# EAGLE design 12V UPS2 (EAGLE 8.0.1)
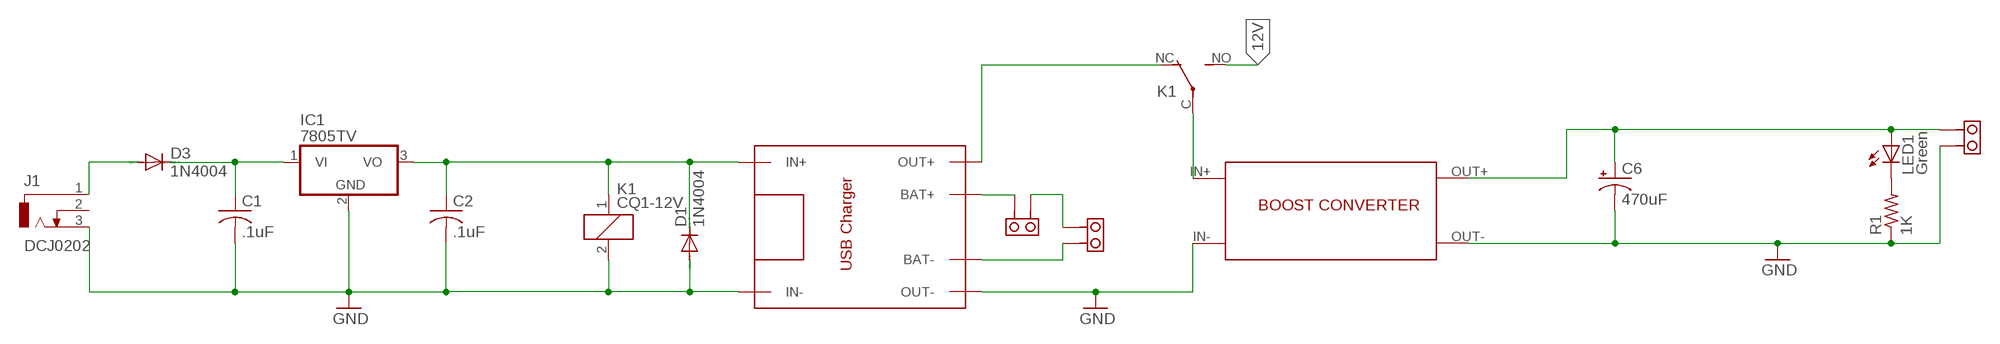
[diagram p0: schematic, sheet 1]

## Parts
C1  .1uF  C-US025-030X050  [C025-030X050]
C2  .1uF  C-US025-030X050  [C025-030X050]
C6  470uF  CPOL-USE5-8.5  [E5-8,5]
D1  1N4004  [DO41-10]
D3  1N4004  [DO41-10]
IC1  7805TV  [TO220V]
J1  DCJ0202  [DCJ0202]
K1  CQ1-12V  [CQ1]
LED1  Green  LED5MM  [LED5MM]
R1  1K  R-US_0204/2V  [0204V]
U$1  TP4056_TH  [TP4056_TH]
U$2  BOOST  [BOOST]
U$3  BERG_2  [BERG_2]
U$5  BERG_2  [BERG_2]
U$6  BERG_2  [BERG_2]

## Nets
12V: C1.1 D3.C IC1.1(VI) K1.NO(2:S)
BAT+: U$5.F U$6.F
BAT-: U$1.BAT- U$5.E
BOOST_IN+: K1.C(2:P) U$2.IN+
GND: C1.2 C2.2 C6.- D1.A IC1.2(GND) J1.3 K1.2 R1.1 U$1.IN- U$1.OUT- U$2.IN- U$2.OUT- U$3.E
N$2: D3.A J1.1
N$3: LED1.K(C) R1.2
N$5: C2.1 D1.C IC1.3(VO) K1.1 U$1.IN+
N$7: K1.NC(2:O) U$1.OUT+
N$8: C6.+ LED1.A U$2.OUT+ U$3.F
N$12: U$1.BAT+ U$6.E
Unconnected: J1.2

## Library data of the parts
C1 C2 = rcl:C-US: CAPACITOR, American symbol
C6 = rcl:CPOL-US: POLARIZED CAPACITOR, American symbol
D1 D3 = diode:1N4004: DIODE general purpose rectifier, 1 A
IC1 = linear:78*: Positive VOLTAGE REGULATOR Source: http://cache.national.com/ds/LM/LM78L05.pdf http://www.fairchildsemi.com/ds/LM/LM7805.pdf
J1 = con-jack:DCJ0202: DC POWER JACK Source: DCJ0202.pdf; OC_FARNELL: unknown; OC_NEWARK: unknown
K1 = relay:CQ1-12V: AUTOMOTIVE QUIET RELAY NAiS Source: http://www.mew-europe.com/.. en_ds_61208_0000.pdf; OC_FARNELL: unknown; OC_NEWARK: unknown
LED1 = led:LED: LED OSRAM: - CHIPLED LG R971, LG N971, LY N971, LG Q971, LY Q971, LO R971, LY R971 LH N974, LH R974 LS Q976, LO Q976, LY Q976 LO Q996 - Hyper CHIPLED LW Q18S LB Q993, LB Q99A, LB R99A - SideLED LS A670, LO A670, LY A670, LG A670, LP A670 LB A673, LV A673, LT A673, LW A673 LH A674 LY A675 LS A676, LA A676, LO A676, LY A676, LW A676 LS A679, LY A679, LG A679 - Hyper Micro SIDELED® LS Y876, LA Y876, LO Y876, LY Y876 LT Y87S - SmartLED LW L88C, LW L88S LB L89C, LB L89S, LG L890 LS L89K, LO L89K, LY L89K LS L896, LA L896, LO L896, LY L896 - TOPLED LS T670, LO T670, LY T670, LG T670, LP T670 LSG T670, LSP T670, LSY T670, LOP T670, LYG T670 LG T671, LOG T671, LSG T671 LB T673, LV T673, LT T673, LW T673 LH T674 LS T676, LA T676, LO T676, LY T676, LB T676, LH T676, LSB T676, LW T676 LB T67C, LV T67C, LT T67C, LS T67K, LO T67K, LY T67K, LW E67C LS E67B, LA E67B, LO E67B, LY E67B, LB E67C, LV E67C, LT E67C LW T67C LS T679, LY T679, LG T679 LS T770, LO T770, LY T770, LG T770, LP T770 LB T773, LV T773, LT T773, LW T773 LH T774 LS E675, LA E675, LY E675, LS T675 LS T776, LA T776, LO T776, LY T776, LB T776 LHGB T686 LT T68C, LB T68C - Hyper Mini TOPLED® LB M676 - Mini TOPLED Santana® LG M470 LS M47K, LO M47K, LY M47K Source: http://www.osram.convergy.de LUXEON: - LUMILED® LXK2-PW12-R00, LXK2-PW12-S00, LXK2-PW14-U00, LXK2-PW14-V00 LXK2-PM12-R00, LXK2-PM12-S00, LXK2-PM14-U00 LXK2-PE12-Q00, LXK2-PE12-R00, LXK2-PE12-S00, LXK2-PE14-T00, LXK2-PE14-U00 LXK2-PB12-K00, LXK2-PB12-L00, LXK2-PB12-M00, LXK2-PB14-N00, LXK2-PB14-P00, LXK2-PB14-Q00 LXK2-PR12-L00, LXK2-PR12-M00, LXK2-PR14-Q00, LXK2-PR14-R00 LXK2-PD12-Q00, LXK2-PD12-R00, LXK2-PD12-S00 LXK2-PH12-R00, LXK2-PH12-S00 LXK2-PL12-P00, LXK2-PL12-Q00, LXK2-PL12-R00 Source: www.luxeon.com KINGBRIGHT: KA-3528ASYC Source: www.kingbright.com
R1 = rcl:R-US_: RESISTOR, American symbol
U$1 = TP4056 charging module:TP4056_TH
U$2 = boost:BOOST
U$3 U$5 U$6 = dragCustom:BERG_2

## Board
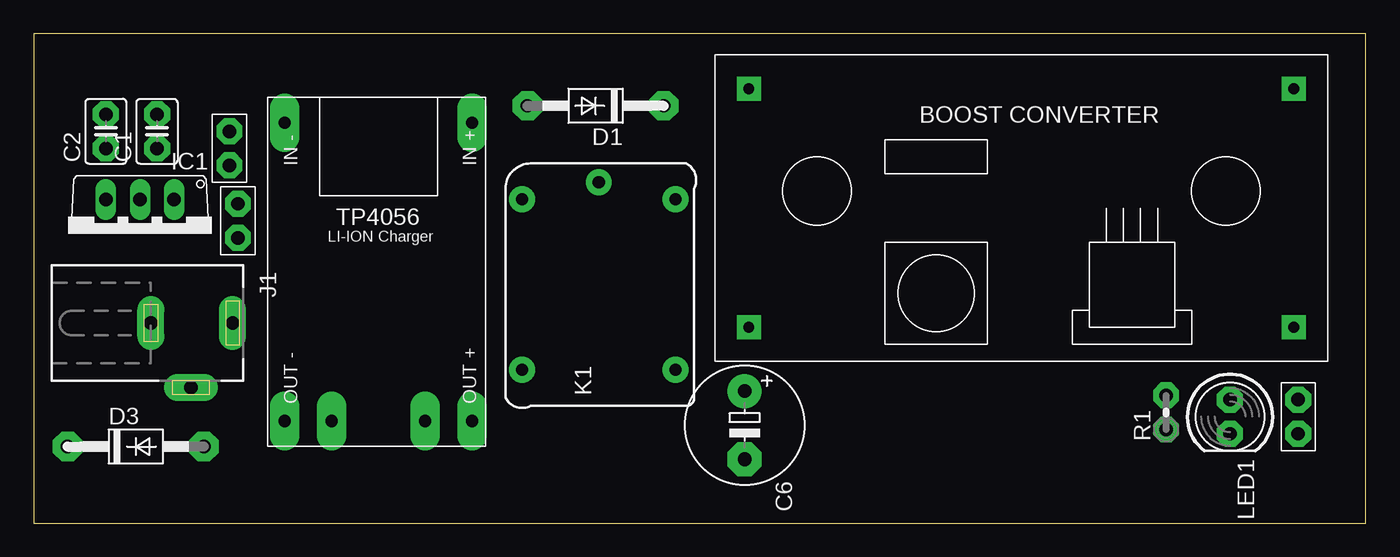
[diagram p1: board, top side]
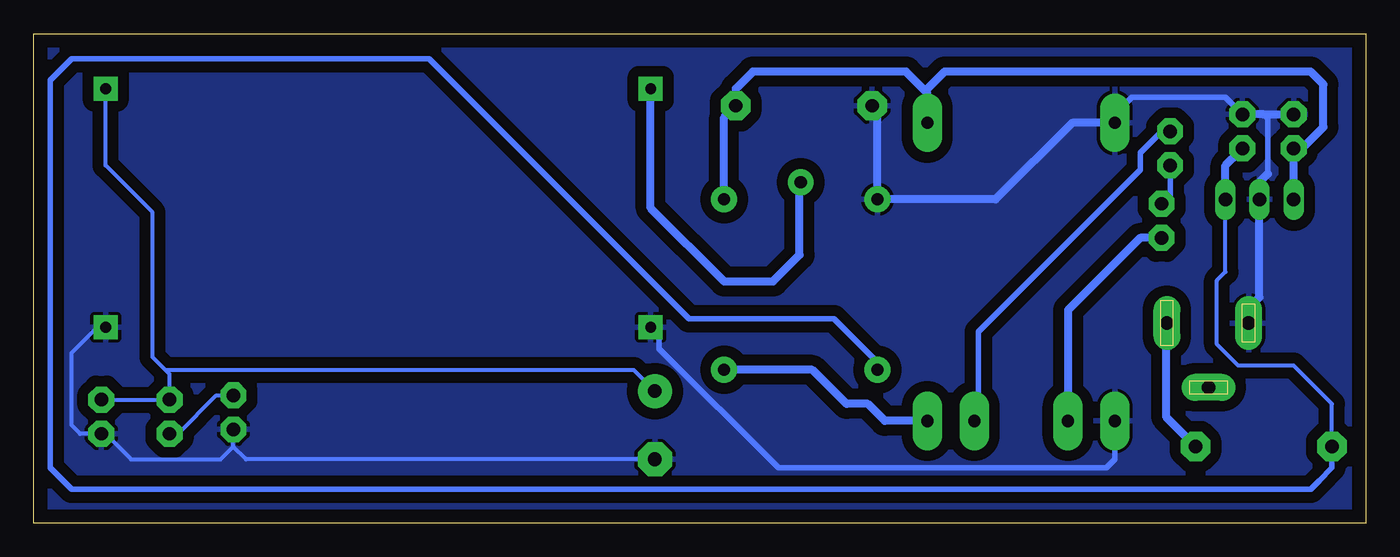
[diagram p2: board, bottom side, seen from below]

Size 99.36 x 36.5 mm. Coordinates in mm from the lower left corner, seen from the top.
Outline: 0,0 99.36,0 99.36,36.5 0,36.5 0,0
Copper layers (1*16): Top 0.035mm / dielectric 1.5mm / Bottom 0.035mm
Design rules "default": minimum track width 10mil, minimum drill 24mil, track to track 8mil, track to pad 8mil, pad to pad 8mil, via to via 8mil, smd to smd 8mil, copper to edge 40mil, drill to drill 8mil, minimum pad ring 10mil, minimum via ring 8mil, stop-mask expansion 4mil, vias tented up to drill 0mil, thermal gap 10mil

### Footprints (pad centres in the part's own frame; a part is rotated, then mirrored left to right if it is on the bottom)
C025-030X050 = drill 1 pad 1.93 octagon: 1 -1.27,0; 2 1.27,0
E5-8,5 = drill 1.016 pad 2.54: + -2.54,0 | drill 1.016 pad 2.54 octagon: - 2.54,0
DO41-10 = drill 1 pad 2.184 octagon: A 5.08,0; C -5.08,0
TO220V = drill 1.016 long: 1 -2.54,-2.54; 2 0,-2.54; 3 2.54,-2.54
DCJ0202 = drill 1 pad 2 long: 1 0,3.1; 2 4.8,0; 3 0,-3
CQ1 = drill 0.9 pad 1.93: 1 7,-5; 2 7,6.43; C 8.27,0.715; NC -5.7,-5; NO -5.7,6.43
LED5MM = drill 1 pad 1.93 octagon: A -1.27,0; K 1.27,0
0204V = drill 1 pad 1.93 octagon: 1 -1.27,0; 2 1.27,0
TP4056_TH = drill 0.9 pad 2.184 long: BAT+ 4.128,-11.43; BAT- -2.857,-11.43; IN+ 7.62,10.795; IN- -6.35,10.795; OUT+ 7.62,-11.43; OUT- -6.35,-11.43
BOOST = drill 0.8 pad 1.778 square: IN+ -20.32,10.16; IN- -20.32,-7.62; OUT+ 20.32,10.16; OUT- 20.32,-7.62
BERG_2 = drill 1 pad 1.93 octagon: E 0,2.54; F 0,0

### Placement (x,y rotation side)
C1  9.21,29.21 90 top
C2  5.4,29.21 90 top
C6  53.02,7.3 270 top
D1  41.91,31.11 180 top
D3  7.62,5.71 0 top
IC1  7.94,21.59 180 top
J1  11.75,14.92 270 top
K1  42.86,17.14 90 top
LED1  89.22,7.94 270 top
R1  84.45,8.26 90 top
U$1  25.08,19.05 0 top
U$2  73.66,22.23 0 top
U$3  94.3,9.21 180 top
U$5  15.24,23.81 180 top
U$6  14.61,26.67 0 top

### Tracks (layer width: path | path; a pad name or v marks a point on that pad's centre or on a via)
12V
  Bottom 0.305: D3.C 2.54,8.89 5.4,11.75 9.53,11.75 11.11,13.34 11.11,18.1 10.48,18.73 IC1.1 | K1.NO 36.43,11.98 | 3.49,3.17 4.13,2.54
  Bottom 0.406: 9.53,27.62 C1.1 | 36.43,11.98 39.69,15.24 50.48,15.24 69.85,34.61 96.52,34.61 98.11,33.02 98.11,4.13 96.52,2.54 4.13,2.54 3.49,3.17 2.54,4.13 D3.C
  Bottom 0.61: IC1.1 10.48,26.67 9.53,27.62
BAT+
  Bottom 0.406: U$6.F 14.61,24.45 U$5.F
BAT-
  Bottom 0.61: U$5.E 16.83,21.27 22.22,15.88 U$1.BAT-
BOOST_IN+
  Bottom 0.305: 42.23,25.34 K1.C
  Bottom 0.61: U$2.IN+ 53.34,23.5 47.86,18.02 44.21,18.02 42.23,20 42.23,25.34
GND
  Bottom 0.305: 84.45,5.71 85.41,4.76 92.08,4.76 93.98,6.67 U$3.E 95.88,6.67 96.52,7.3 96.52,12.7 94.61,14.61 U$2.OUT- | 84.45,5.71 R1.1 | C6.- 83.5,4.76 84.45,5.71
  Bottom 0.406: 18.73,30.48 18.73,31.75 | 18.73,30.48 U$1.IN- | IC1.2 7.94,25.4 | 7.3,26.04 7.3,30.16 7.62,30.48 | C1.2 10.48,31.75 17.46,31.75 18.73,30.48 | U$1.OUT- 18.73,4.76 19.37,4.13 43.82,4.13 52.71,13.02 52.71,13.97 U$2.IN- 53.02,14.29
  Bottom 0.61: C1.2 7.62,30.48 C2.2 | 7.94,25.4 7.3,26.04 | U$1.IN- 21.91,29.84 27.62,24.13 36.42,24.13 | K1.2 36.43,30.72 | J1.3 8.75,16.02 7.94,16.83 IC1.2
  Bottom 0.813: 36.42,24.13 K1.2 | 36.43,30.72 D1.A
  pour Bottom (isolate 0.813): 0,36.51 99.38,36.51 99.38,0 0,0
N$2
  Bottom 0.305: D3.A 13.65,5.71
  Bottom 0.406: 14.92,14.85 J1.1
  Bottom 0.61: 14.92,14.85 14.92,8.89 14.92,7.94 D3.A
N$3
  Bottom 0.305: LED1.K 88.58,6.67 85.72,9.53 R1.2
N$5
  Bottom 0.305: C2.1 4.76,27.94
  Bottom 0.406: 32.7,32.38 U$1.IN+ 32.7,32.07
  Bottom 0.61: IC1.3 C2.1 | 32.7,32.07 34.29,33.66 45.72,33.66 46.99,32.38 D1.C 47.86,30.24 K1.1 | 32.7,32.38 31.43,33.66 4.13,33.66 3.17,32.7 3.17,29.53 4.76,27.94
N$7
  Bottom 0.305: 47.85,11.43 K1.NC
  Bottom 0.61: U$1.OUT+ 35.88,7.62 37.15,8.89 38.74,8.89 41.28,11.43 47.85,11.43
N$8
  Bottom 0.305: U$3.F LED1.A 89.22,11.11 89.53,11.43 | 89.53,11.43 54.61,11.43 C6.+ | 89.53,11.43 90.49,12.38 90.49,23.18 93.98,26.67 U$2.OUT+
N$12
  Bottom 0.406: U$6.E 15.24,29.21 16.83,27.62 16.83,26.35 28.89,14.29 28.89,7.94 U$1.BAT+